# EAGLE design m328p_rfm69_node (EAGLE 7.2.0)
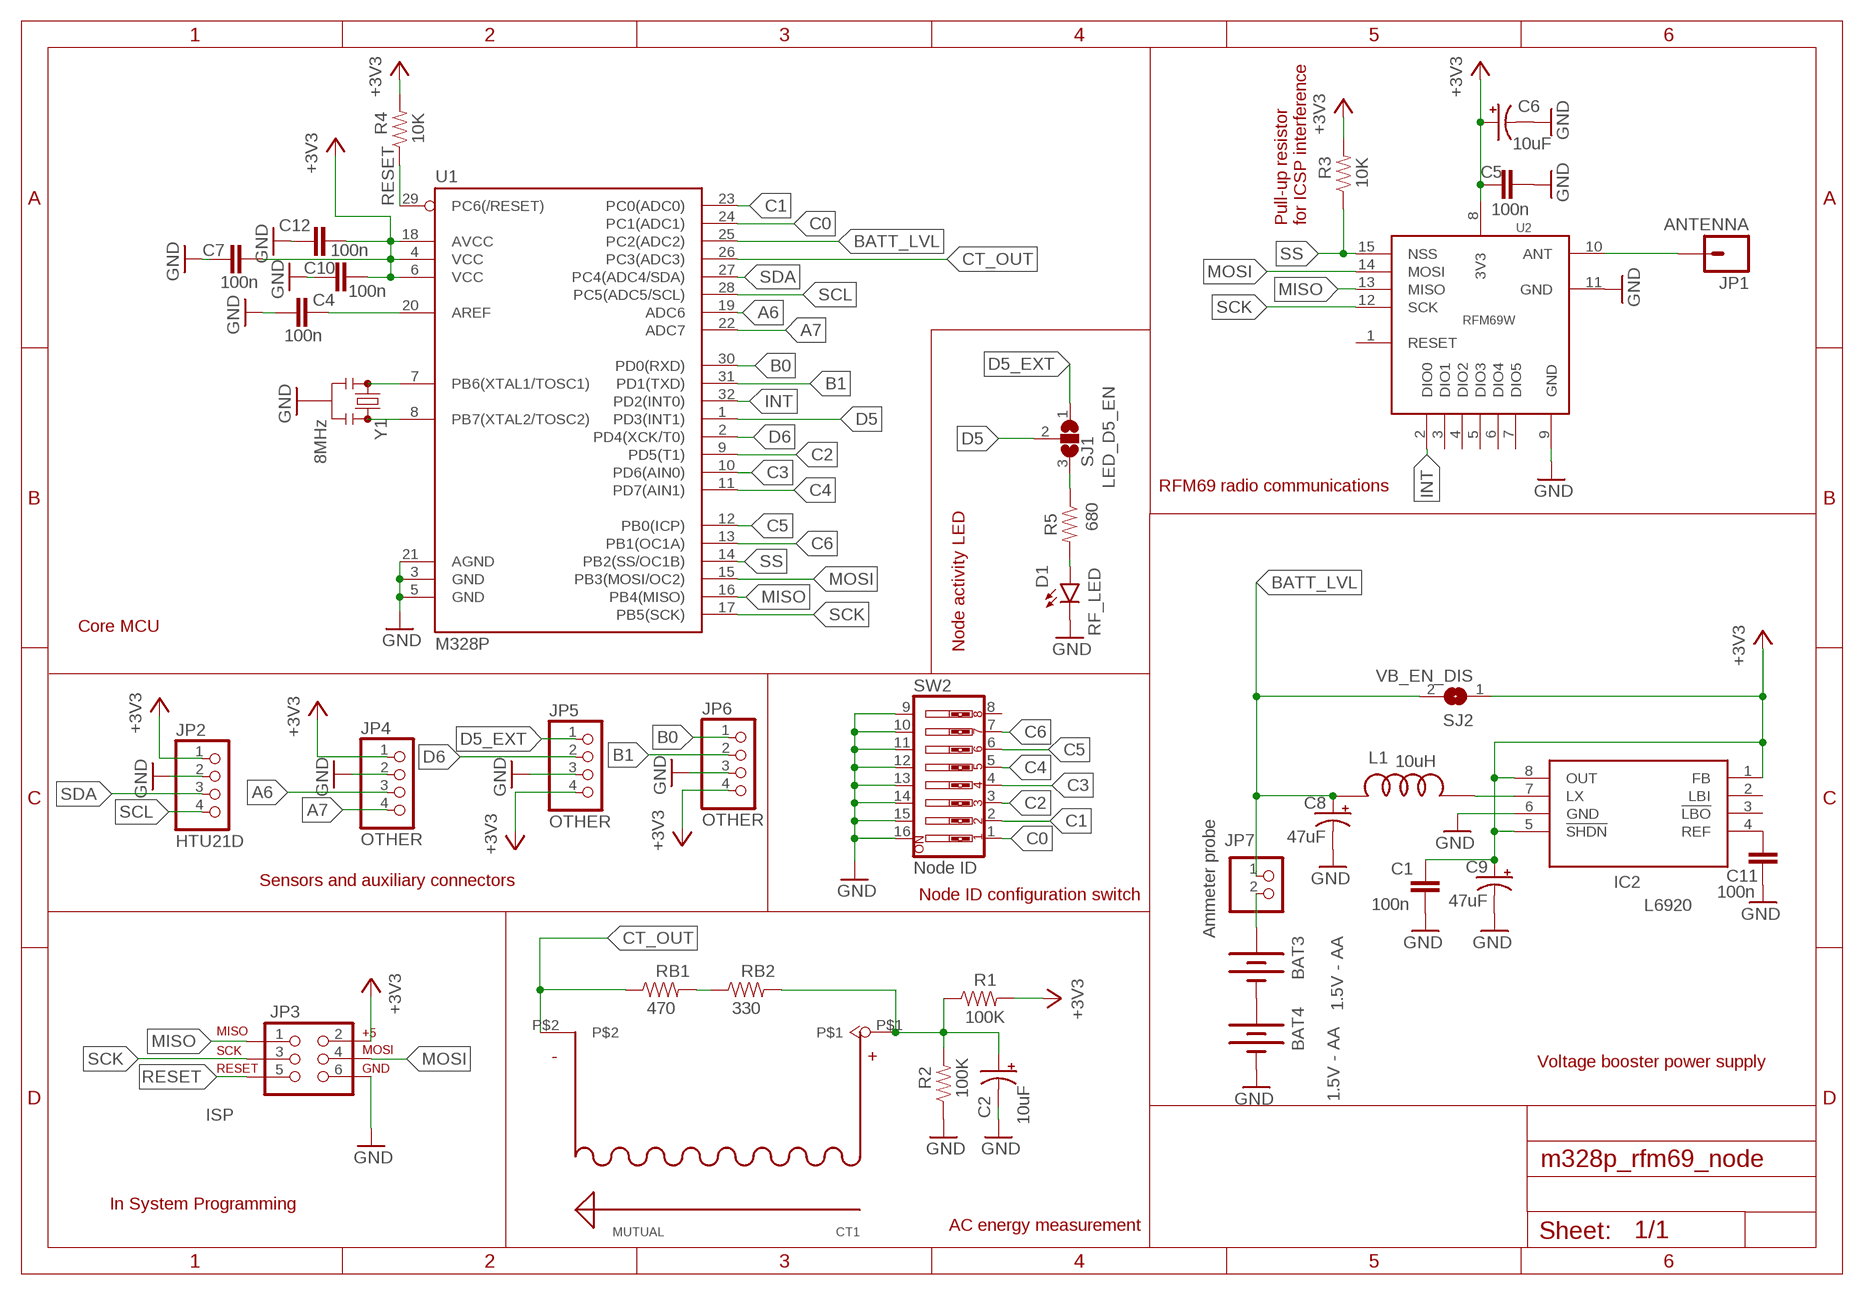
[diagram p0: schematic, sheet 1]

## Parts
BAT3  1.5V - AA  BATTERYAA-KIT  [BATTERY-AA-KIT]
BAT4  1.5V - AA  BATTERYAA-KIT  [BATTERY-AA-KIT]
C1  100n  CAP0805  [0805]
C2  10uF  47UF-TANT  [EIA3528]
C4  100n  CAP0805  [0805]
C5  100n  CAP0805  [0805]
C6  10uF  47UF-TANT  [EIA3528]
C7  100n  CAP0805  [0805]
C8  47uF  47UF-TANT  [EIA3528]
C9  47uF  47UF-TANT  [EIA3528]
C10  100n  CAP0805  [0805]
C11  100n  CAP0805  [0805]
C12  100n  CAP0805  [0805]
CT1  MUTUAL  [MUTUAL]
D1  RF_LED  LED0603  [LED-0603]
IC2  L6920  L6920TSSOP8  [TSSOP8]
JP1  ANTENNA  M01SMD  [LUXEON-PAD]
JP2  HTU21D  PINHD-1X4  [1X04]
JP3  ISP  AVR_SPI_PRG_6NS  [2X3-NS]
JP4  OTHER  PINHD-1X4  [1X04]
JP5  OTHER  PINHD-1X4  [1X04]
JP6  OTHER  PINHD-1X4  [1X04]
JP7  Ammeter probe  PINHD-1X2  [1X02]
L1  10uH  DLJ-4018  [DLJ-4018]
R1  100K  RESISTOR0805-RES  [0805]
R2  100K  RESISTOR0805-RES  [0805]
R3  10K  RESISTOR0805-RES  [0805]
R4  10K  RESISTOR0805-RES  [0805]
R5  680  RESISTOR0805-RES  [0805]
RB1  470  RESISTOR0805-RES  [0805]
RB2  330  RESISTOR0805-RES  [0805]
SJ1  LED_D5_EN  SJ2W  [SJ_2]
SJ2  VB_EN_DIS  SJ  [SJ]
SW2  Node ID  SW_DIP-8-SMT-HALFSIZE  [DIPSWITCH-08-50MIL]
U1  M328P  ATMEGA328P_TQFP  [TQFP32-08]
U2  RFM69W  [RFM69W]
Y1  8MHz  RESONATOR4MHZ  [RESONATOR-SMD_MED]

## Nets
+3V3: C1.1 C5.1 C6.A(+) C7.2 C9.A(+) C10.2 C12.2 IC2.1(FB) IC2.5(!SHDN) IC2.8(OUT) JP2.1 JP3.2 JP4.1 JP5.4 JP6.4 R1.2 R3.2 R4.2 SJ2.1 U1.4(VCC) U1.6(VCC) U1.18(AVCC) U2.8(3V3)
A6: JP4.3 U1.19(ADC6)
A7: JP4.4 U1.22(ADC7)
B0: JP6.1 U1.30(PD0(RXD))
B1: JP6.2 U1.31(PD1(TXD))
BATT_LVL: C8.A(+) JP7.1 L1.P$2 SJ2.2 U1.25(PC2(ADC2))
C0: SW2.1 U1.24(PC1(ADC1))
C1: SW2.2 U1.23(PC0(ADC0))
C2: SW2.3 U1.9(PD5(T1))
C3: SW2.4 U1.10(PD6(AIN0))
C4: SW2.5 U1.11(PD7(AIN1))
C5: SW2.6 U1.12(PB0(ICP))
C6: SW2.7 U1.13(PB1(OC1A))
CT_OUT: CT1.P$2 RB1.1 U1.26(PC3(ADC3))
D5: SJ1.2 U1.1(PD3(INT1))
D5_EXT: JP5.1 SJ1.1
D6: JP5.2 U1.2(PD4(XCK/T0))
GND: BAT4.GND@1(-) C1.2 C2.C(-) C4.1 C5.2 C6.C(-) C7.1 C8.C(-) C9.C(-) C10.1 C11.2 C12.1 D1.C IC2.6(GND) JP2.2 JP3.6 JP4.2 JP5.3 JP6.3 R2.1 SW2.9 SW2.10 SW2.11 SW2.12 SW2.13 SW2.14 SW2.15 SW2.16 U1.3(GND) U1.5(GND) U1.21(AGND) U2.9(GND) U2.11(GND) Y1.2
INT: U1.32(PD2(INT0)) U2.2(DIO0)
MISO: JP3.1 U1.16(PB4(MISO)) U2.13(MISO)
MOSI: JP3.4 U1.15(PB3(MOSI/OC2)) U2.14(MOSI)
N$1: IC2.7(LX) L1.P$1
N$2: D1.A R5.2
N$3: RB1.2 RB2.1
N$4: C11.1 IC2.4(REF)
N$5: BAT3.PWR@1(+) JP7.2
N$6: U1.8(PB7(XTAL2/TOSC2)) Y1.3
N$8: BAT3.GND@1(-) BAT4.PWR@1(+)
N$9: U1.7(PB6(XTAL1/TOSC1)) Y1.1
N$10: JP1.P$1 U2.10(ANT)
N$11: C2.A(+) CT1.P$1 R1.1 R2.2 RB2.2
N$12: C4.2 U1.20(AREF)
N$13: R5.1 SJ1.3
RESET: JP3.5 R4.1 U1.29(PC6(/RESET))
SCK: JP3.3 U1.17(PB5(SCK)) U2.12(SCK)
SCL: JP2.4 U1.28(PC5(ADC5/SCL))
SDA: JP2.3 U1.27(PC4(ADC4/SDA))
SS: R3.1 U1.14(PB2(SS/OC1B)) U2.15(NSS)
Unconnected: IC2.2(LBI) IC2.3(!LBO) SW2.8 U2.1(RESET) U2.3(DIO1) U2.4(DIO2) U2.5(DIO3) U2.6(DIO4) U2.7(DIO5)

## Notes on the sheet
- Pull-up resistor
  for ICSP interference
- RFM69 radio communications
- Core MCU
- Node activity LED
- Sensors and auxiliary connectors
- Node ID configuration switch
- Voltage booster power supply
- In System Programming
- AC energy measurement

## Library data of the parts
BAT3 BAT4 = SparkFun-Electromechanical:BATTERY: Battery Holders Various common sizes : AA, AAA, 18650 (PRT-12895), 20mm coin cell and 12mm coin cell. 20MM_4LEGS, BATT-10373; PROD_ID: BATT-08316
C1 C4 C5 C7 C10-C12 = SparkFun-Capacitors:CAP: Capacitor Standard 0603 ceramic capacitor, and 0.1" leaded capacitor.
C2 C6 = SparkFun-Capacitors:47UF-TANT: 47uF Tantalum SMT CAP-08310- 10V 10% (EIA-3528); PROD_ID: CAP-08310; VALUE: 47uF
C8 C9 = SparkFun-Capacitors:47UF-TANT: 47uF Tantalum SMT CAP-08310- 10V 10% (EIA-3528); PROD_ID: CAP-08310
CT1 = Electricity_sensor:MUTUAL
D1 = SparkFun-LED:LED: LEDs Standard schematic elements and footprints for 5mm, 3mm, 1206, and 0603 sized LEDs. 5mm - Spark Fun Electronics SKU : COM-00529 (and others)
IC2 = l6920:L6920
JP1 = SparkFun-Connectors:M01: Header 1 Standard 1-pin 0.1" header. Use with straight break away headers (SKU : PRT-00116), right angle break away headers (PRT-00553), swiss pins (PRT-00743), machine pins (PRT-00117), and female headers (PRT-00115).
JP2 JP4-JP6 = pinhead:PINHD-1X4: PIN HEADER
JP3 = SparkFun-Connectors:AVR_SPI_PRG_6: AVR ISP 6 Pin This is the reduced ISP connector for AVR programming. Common on Arduino. This footprint will take up less PCB space and can be used with a 10-pin to 6-pin adapter such as SKU: BOB-08508 **Special note about "TEST_POINT" package. The stop mask is on the top side, so if you want your programming test points to be on the bottom of your board, make sure to place this package on the bottom side of the board. This also ensure that the orientation to program from the bottom side will be correct.
JP7 = pinhead:PINHD-1X2: PIN HEADER
L1 = dlj-4018:DLJ-4018
R1-R4 RB1 RB2 = SparkFun-Resistors:RESISTOR: Resistor Basic schematic elements and footprints for 0603, 1206, and PTH resistors.
R5 = SparkFun-Passives:RESISTOR: Resistor Basic schematic elements and footprints for 0603, 1206, and PTH resistors.
SJ1 = jumper:SJ2W: SMD solder JUMPER
SJ2 = jumper:SJ: SMD solder JUMPER
SW2 = SparkFun-Electromechanical:SW_DIP-8: DIP Switch 8 Position
U1 = SparkFun-DigitalIC:ATMEGA328P_TQFP; PROD_ID: IC-09069; VALUE: ATMEGA328P_TQFP
U2 = rfm69w:RFM69W: Radio Transceiver Module, FSK, 433, 848, 915 MHz, SPI controlled, Mfr=HopeRF
Y1 = SparkFun-FreqCtrl:RESONATOR: Resonator Small SMD resonator. Used, eg, on the Arduino Pro/ Pro Mini boards. 8MHz- XTAL-08895 16MHz- XTAL-08900; PROD_ID: XTAL-12492; VALUE: 4MHz

## Board
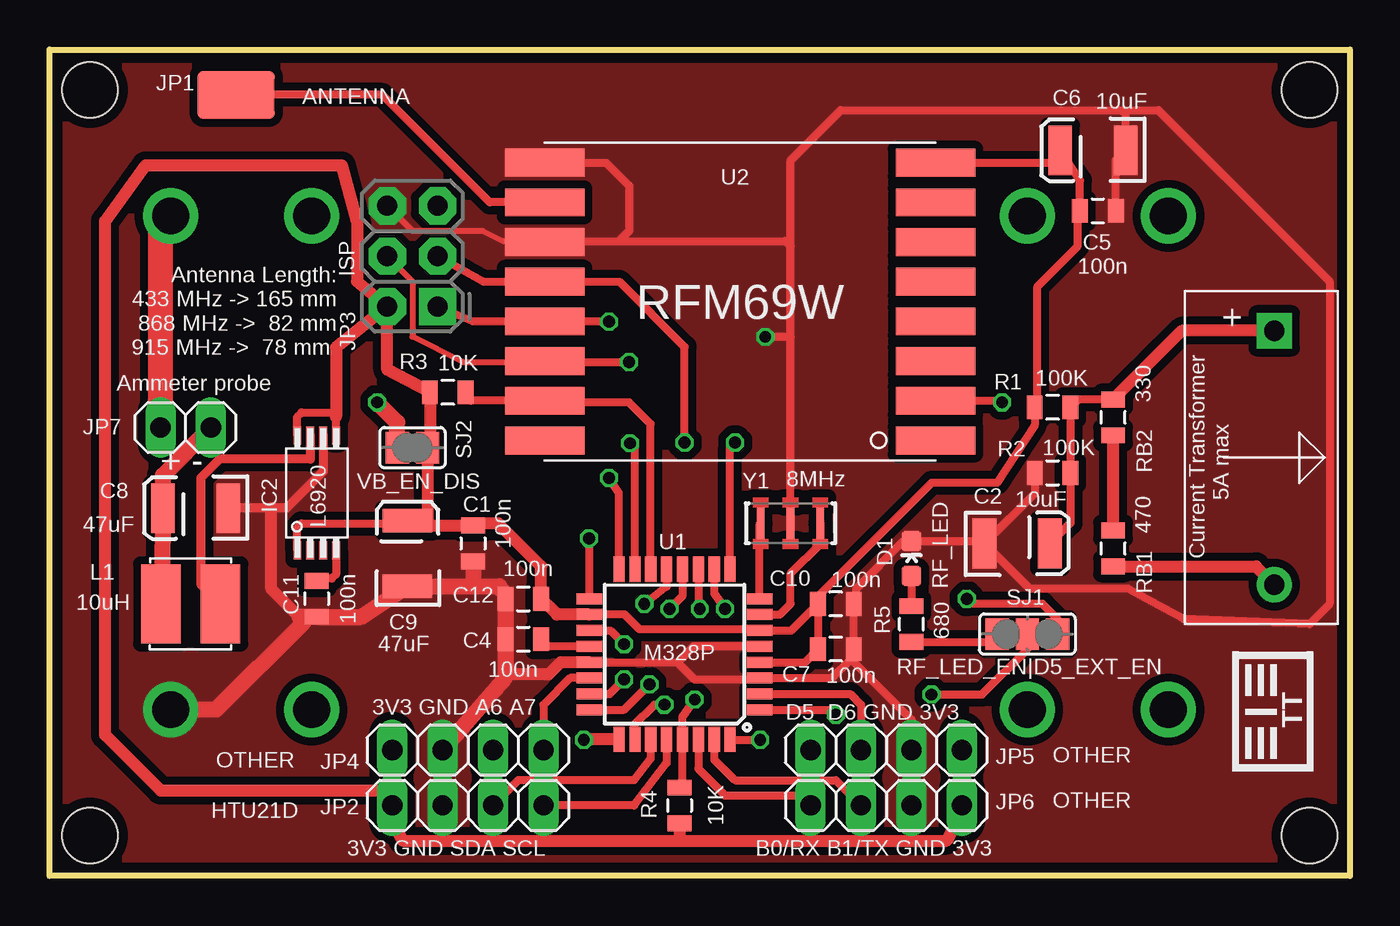
[diagram p1: board, top side]
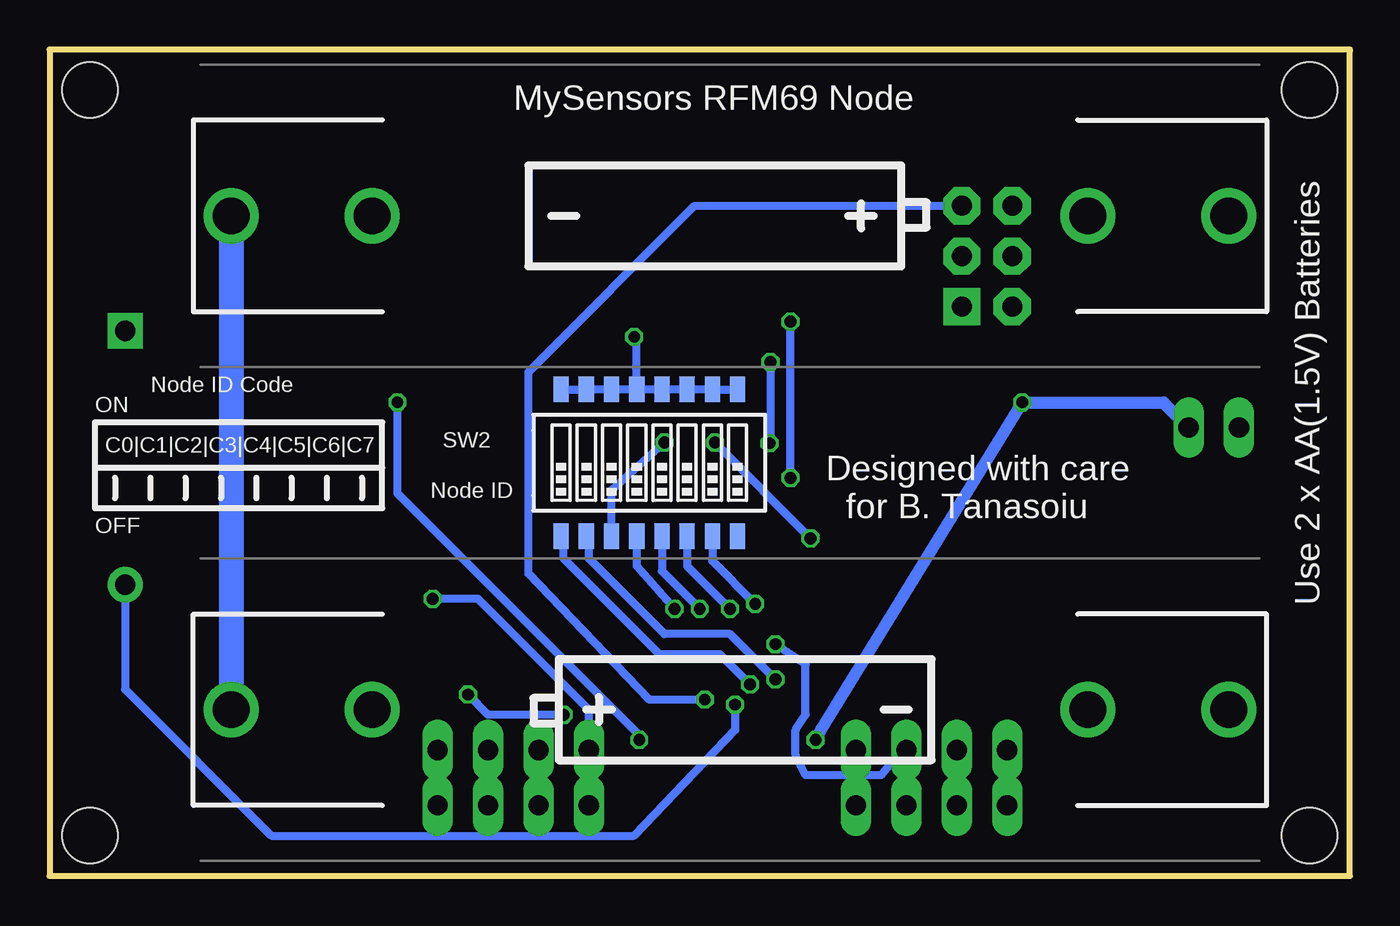
[diagram p2: board, bottom side, seen from below]

Size 65.53 x 41.66 mm. Coordinates in mm from the lower left corner, seen from the top.
Outline: 0,41.66 65.53,41.66 65.53,0
Outline: 65.51,0 0,0 0,41.58
Copper layers (1*16): Top 0.035mm / dielectric 1.5mm / Bottom 0.035mm
Design rules "smart-proto *": minimum track width 7mil, minimum drill 12mil, track to track 7mil, track to pad 7mil, pad to pad 7mil, via to via 7mil, smd to smd 0mil, copper to edge 20mil, drill to drill 10mil, minimum pad ring 10mil, minimum via ring 6mil, stop-mask expansion 2mil, vias tented up to drill 25mil, thermal gap 10mil
Holes 2.8 mm at 2.03,39.62 2.03,2.03 63.5,2.03 63.5,39.62

### Footprints (pad centres in the part's own frame; a part is rotated, then mirrored left to right if it is on the bottom)
BATTERY-AA-KIT = drill 1.854: GND@1 25.146,0; GND@2 18.034,0; PWR@1 -25.146,0; PWR@2 -18.034,0
0805 = smd 0.8 x 1.2: 1 -0.9,0; 2 0.9,0
EIA3528 = smd 1.2 x 2.5: A 1.65,0; C -1.65,0
MUTUAL = drill 1.016 pad 1.778 square: P$1 -6.4,0 | drill 1.016 pad 1.778: P$2 6.4,0
LED-0603 = smd 1 x 1: A 0,-0.877; C 0,0.877
TSSOP8 = smd 0.4 x 0.9: 1 -0.975,-2.9; 2 -0.325,-2.9; 3 0.325,-2.9; 4 0.975,-2.9; 5 0.975,2.9; 6 0.325,2.9; 7 -0.325,2.9; 8 -0.975,2.9
LUXEON-PAD = smd 3.9 x 2.4: P$1 0,0
1X04 = drill 1.016 long: 1 -3.81,0; 2 -1.27,0; 3 1.27,0; 4 3.81,0
2X3-NS = drill 1.016 pad 1.88 square: 1 -2.54,-1.27 | drill 1.016 pad 1.88 octagon: 2 -2.54,1.27; 3 0,-1.27; 4 0,1.27; 5 2.54,-1.27; 6 2.54,1.27
1X02 = drill 1.016 long: 1 -1.27,0; 2 1.27,0
DLJ-4018 = smd 4 x 2: P$1 0,-1.5; P$2 0,1.5
SJ_2 = smd 1.168 x 1.6: 1 -1.524,0; 2 0,0; 3 1.524,0
SJ = smd 1.168 x 1.6: 1 -0.762,0; 2 0.762,0
DIPSWITCH-08-50MIL = smd 0.762 x 1.27: 1 -4.445,-3.7; 2 -3.175,-3.7; 3 -1.905,-3.7; 4 -0.635,-3.7; 5 0.635,-3.7; 6 1.905,-3.7; 7 3.175,-3.7; 8 4.445,-3.7; 9 4.445,3.7; 10 3.175,3.7; 11 1.905,3.7; 12 0.635,3.7; 13 -0.635,3.7; 14 -1.905,3.7; 15 -3.175,3.7; 16 -4.445,3.7
TQFP32-08 = smd 1.27 x 0.559: 1 -4.293,2.8; 2 -4.293,2; 3 -4.293,1.2; 4 -4.293,0.4; 5 -4.293,-0.4; 6 -4.293,-1.2; 7 -4.293,-2; 8 -4.293,-2.8; 17 4.293,-2.8; 18 4.293,-2; 19 4.293,-1.2; 20 4.293,-0.4; 21 4.293,0.4; 22 4.293,1.2; 23 4.293,2; 24 4.293,2.8 | smd 0.559 x 1.27: 9 -2.8,-4.293; 10 -2,-4.293; 11 -1.2,-4.293; 12 -0.4,-4.293; 13 0.4,-4.293; 14 1.2,-4.293; 15 2,-4.293; 16 2.8,-4.293; 25 2.8,4.293; 26 2,4.293; 27 1.2,4.293; 28 0.4,4.293; 29 -0.4,4.293; 30 -1.2,4.293; 31 -2,4.293; 32 -2.8,4.293
RFM69W = smd 4 x 1.4: 1 -9.85,7; 2 -9.85,5; 3 -9.85,3; 4 -9.85,1; 5 -9.85,-1; 6 -9.85,-3; 7 -9.85,-5; 8 -9.85,-7; 9 9.85,-7; 10 9.85,-5; 11 9.85,-3; 12 9.85,-1; 13 9.85,1; 14 9.85,3; 15 9.85,5; 16 9.85,7
RESONATOR-SMD_MED = smd 0.4 x 1.6: 1 -1.5,0; 2 0,0; 3 1.5,0

### Placement (x,y rotation side)
BAT3  31.24,33.27 180 bottom
BAT4  31.24,8.38 0 bottom
C1  21.34,16.76 270 top
C2  48.77,16.76 0 top
C4  23.88,11.94 0 top
C5  52.83,33.53 0 top
C6  52.58,36.58 180 top
C7  39.62,11.43 180 top
C8  7.37,18.54 180 top
C9  18.03,16.26 90 top
C10  39.62,13.72 180 top
C11  13.46,13.97 270 top
C12  23.88,13.97 0 top
CT1  61.72,21.08 270 top
D1  43.43,16 0 top
IC2  13.46,19.3 0 top
JP1  9.4,39.37 0 top
JP2  21.08,3.56 0 top
JP3  18.29,31.24 90 top
JP4  21.08,6.35 0 top
JP5  42.16,6.35 0 top
JP6  42.16,3.56 0 top
JP7  6.86,22.61 180 top
L1  7.11,13.72 90 top
R1  50.55,23.62 180 top
R2  50.55,20.32 0 top
R3  20.07,24.38 180 top
R4  31.75,3.56 270 top
R5  43.43,12.7 90 top
RB1  53.59,16.51 90 top
RB2  53.59,23.11 90 top
SJ1  49.28,12.19 180 top
SJ2  18.29,21.59 180 top
SW2  35.31,20.83 0 bottom
U1  31.5,11.18 180 top
U2  34.8,28.96 180 top
Y1  37.34,17.78 180 top

### Tracks (layer width: path | path; a pad name or v marks a point on that pad's centre or on a via)
+3V3
  Top 0.406: U1.18 27.23,13.21 28.96,13.21 29.72,12.45 35.72,12.45 U1.6 37.38,12.38 C10.2 | JP3.2 17.27,29.21 | C10.2 38.72,13.32 | U1.4 38.07,10.78 C7.2 C10.2 | C10.2 38.72,14.09 44.45,19.81 47.75,19.81 49.65,22.72 R1.2 49.78,23.76 49.78,29.72 51.82,31.75 51.82,33.41 C5.1 51.93,35.06 C6.A 50.56,35.96 U2.8 | IC2.8 12.49,23.16 12.7,23.37 14.22,23.37 14.44,23.16 IC2.5 | 21.09,17.65 C1.1 | IC2.1 12.49,17.57 12.7,17.78 17.91,17.78 C9.A
  Top 0.61: JP5.4 JP6.4 45.97,3.3 45.21,1.78 31.75,1.78 | JP2.1 JP4.1 | 31.75,1.78 17.78,1.78 17.27,2.79 JP2.1 | U1.18 25.57,13.18 C12.2 24.78,15.61 22.61,17.78 21.45,17.78 C1.1 | R4.2 31.75,1.78 | JP3.2 15.49,29.97 15.49,33.02 14.73,35.81 4.83,35.81 2.79,33.02 2.79,7.11 5.59,4.32 17.02,4.32 JP2.1 | JP3.2 17.02,25.52 R3.2 19.17,21.71 SJ2.1 19.05,17.65 | JP3.2 14.44,26.63 14.44,23.16 | 21.09,17.65 19.05,17.65 | 19.05,17.65 18.29,17.65 C9.A
A6  (via drill 0.6)
  Top 0.406: U1.19 28.26,12.38 v28.96,11.68
  Bottom 0.406: JP4.3 22.61,6.35 23.62,5.08 27.43,5.08 27.94,6.1 27.94,7.37 27.43,8.13 27.43,10.67 v28.96,11.68
A7
  Top 0.406: U1.22 26.23,9.98 24.89,8.64 JP4.4
B0
  Top 0.406: U1.30 32.7,5.4 34.04,4.06 37.85,4.06 JP6.1
B1
  Top 0.406: U1.31 33.5,5.87 34.54,4.83 39.62,4.83 JP6.2
BATT_LVL  (via drill 0.6)
  Top 0.61: U1.25 26.95,6.88 v26.92,6.86
  Top 0.813: SJ2.2 17.53,22.86 v16.51,23.88 | L1.P$2 C8.A 5.72,20.19 JP7.1
  Bottom 0.61: v26.92,6.86 26.64,7.39 v16.51,23.88 9.4,23.88 JP7.1
C0  (via drill 0.6)
  Top 0.406: U1.24 28.95,8.38 v30.23,9.65
  Bottom 0.406: v30.23,9.65 31.75,11.18 34.8,11.18 39.62,16 39.62,17 SW2.1
C1  (via drill 0.6)
  Top 0.406: U1.23 28.23,9.18 v28.96,9.91
  Bottom 0.406: v28.96,9.91 31.24,12.19 34.54,12.19 38.35,16 38.35,17 SW2.2
C2  (via drill 0.6)
  Top 0.406: U1.9 34.3,21.6 v34.54,21.84
  Bottom 0.406: SW2.3 37.21,19.43 v34.54,21.84
C3  (via drill 0.6)
  Top 0.406: U1.10 33.5,14.26 v34.04,13.46
  Bottom 0.406: SW2.4 35.94,15.62 v34.04,13.46
C4  (via drill 0.6)
  Top 0.406: U1.11 32.7,13.53 v32.77,13.46
  Bottom 0.406: SW2.5 34.67,15.37 v32.77,13.46
C5  (via drill 0.6)
  Top 0.406: U1.12 31.9,14.12 v31.24,13.46
  Bottom 0.406: SW2.6 33.4,15.62 v31.24,13.46
C6  (via drill 0.6)
  Top 0.406: U1.13 31.1,14.59 v29.97,13.72
  Bottom 0.406: SW2.7 32.13,15.88 v29.97,13.72
CT_OUT  (via drill 0.6)
  Top 0.406: U1.26 29.46,6.92 29.46,7.62 30.48,8.64 v30.99,8.64
  Top 0.61: RB1.1 60.79,15.61 CT1.P$2
  Bottom 0.406: CT1.P$2 61.72,9.4 54.36,2.03 36.07,2.03 30.99,7.37 v30.99,8.64
D5  (via drill 0.6)
  Top 0.406: U1.1 39.38,8.38 v39.62,8.13 | v44.45,9.14 46.99,9.14 49.28,11.43 SJ1.2
  Bottom 0.406: v39.62,8.13 43.43,8.13 v44.45,9.14
D5_EXT  (via drill 0.6)
  Top 0.406: SJ1.1 50.8,12.95 50.04,13.72 46.48,13.72 v46.23,13.97
  Bottom 0.406: JP5.1 38.35,8.38 43.94,13.97 v46.23,13.97
D6
  Top 0.406: U1.2 40.35,9.18 40.89,8.64 JP5.2
GND  (via drill 0.6)
  Top 0.305: JP3.6 18.29,32.51 21.84,32.51 22.86,32 24.9,32 U2.11
  Top 0.406: U1.21 31.64,10.78 | 31.64,10.78 32.51,9.91 35.72,9.91 U1.3 39.44,9.98 40.39,10.92 | U1.5 32.44,11.58 31.64,10.78 | R2.1 49.65,19.29 C2.C | Y1.2 37.34,27.18 | 37.34,27.18 37.34,31.75 | U2.11 25,32 28.7,32 | 28.7,32 37.08,32 37.34,31.75 | C12.1 22.98,14.22 | 40.39,10.92 40.39,11.29 C7.1 C10.1 40.64,13.83 40.64,14.48 43.04,16.88 D1.C 46.49,16.88 C2.C | U2.9 28.05,35.96 29.21,34.8 29.21,32.51 28.7,32 | 22.66,14.61 22.66,14.54 | 21.34,14.86 21.59,14.61 | v36.07,27.18 37.34,27.18 | 37.34,31.75 37.34,36.07 39.88,38.61 53.85,38.61 | 53.85,38.61 55.88,38.61 64.52,29.97 64.52,13.72 63.5,12.7 57.15,12.95 54.36,14.48 49.4,14.48 C2.C | C5.2 53.73,36.08 C6.C 54.23,38.48 53.85,38.61 | 40.39,10.92 43.43,7.87 JP5.3 JP6.3 | 47.24,16.13 C2.C
  Top 0.457: IC2.6 13.79,20.39 11.94,18.54 11.18,18.54 C8.C
  Top 0.61: U1.21 25.76,10.78 25.15,10.16 22.98,10.16 | 12.58,13.07 11.18,14.48 11.18,18.54
  Top 0.813: JP2.2 JP4.2 22.98,10.02 22.98,10.16 C4.1 C12.1 | 22.98,14.22 22.66,14.54 | 22.66,14.61 21.59,14.61 C9.C 15.74,13.07 C11.2 12.82,13.07 | C1.2 21.34,14.86 | 12.82,13.07 12.58,13.07 | 12.82,13.07 12.82,12.82 8.38,8.38 BAT4.GND@1
  Bottom 0.406: SW2.13 SW2.12 SW2.11 SW2.10 SW2.9 | SW2.13 SW2.14 SW2.15 SW2.16 | SW2.13 35.94,27.05 v36.07,27.18
  pour Top (isolate 0.406, no thermals): 0,41.66 65.53,41.66 65.53,0 0,0
INT  (via drill 0.6)
  Top 0.406: U1.32 34.3,6.85 36.06,6.85 v35.81,6.86 | 44.57,23.88 U2.2 47.93,23.96 v48.01,23.88
  Bottom 0.406: v35.81,6.86 35.81,7.11 48.01,19.3 v48.01,23.88
MISO  (via drill 0.6)
  Top 0.406: v28.19,27.94 24.96,27.94 U2.13 21.32,27.96 JP3.1 | U1.16 28.7,19.31 v28.19,20.07
  Bottom 0.406: v28.19,20.07 v28.19,27.93 v28.19,27.94
MOSI  (via drill 0.6)
  Top 0.305: JP3.4 18.29,29.97 18.29,27.18 20.83,25.91 24.9,25.91 U2.14
  Top 0.406: U2.14 25,25.91 v29.21,25.91 | U1.15 29.5,21.56 v29.24,21.81
  Bottom 0.406: v29.21,25.91 29.21,21.84 v29.24,21.81
N$1
  Top 0.457: IC2.7 13.14,21.01 8.56,21.01 7.62,20.07 7.62,14.71 L1.P$1
N$2
  Top 0.406: D1.A R5.2
N$3
  Top 0.61: RB2.1 RB1.2
N$4
  Top 0.406: IC2.4 14.44,15.2 14.22,14.99 13.58,14.99 C11.1
N$5
  Top 1.27: JP7.2 5.59,32.77 BAT3.PWR@1
N$6
  Top 0.406: U1.8 35.79,17.73 Y1.3
N$8
  Bottom 1.27: BAT3.GND@1 BAT4.PWR@1
N$9
  Top 0.406: U1.7 36.8,13.18 37.34,13.72 37.34,15.24 38.86,16.76 38.86,17.76 Y1.1
N$10
  Top 0.406: U2.10 22.18,33.96 16.76,39.37 JP1.P$1
N$11
  Top 0.406: C2.A 51.45,17.79 R2.2 R1.1 51.84,24.01 RB2.2
  Top 0.61: RB2.2 57.06,27.48 CT1.P$1
N$12
  Top 0.406: U1.20 25.14,11.58 C4.2
N$13
  Top 0.406: R5.1 47.36,11.8 SJ1.3
RESET  (via drill 0.6)
  Top 0.406: R4.1 31.87,4.57 31.87,6.85 U1.29 31.9,8.02 v32.51,8.89
  Bottom 0.406: v32.51,8.89 35.31,8.89 41.4,15.24 41.4,25.4 33.02,33.78 JP3.5
SCK  (via drill 0.6)
  Top 0.406: v27.18,17.02 27.18,14 U1.17 | JP3.3 21.84,29.97 24.93,29.97 U2.12 28.72,29.96 32,26.67 v32,21.84
  Bottom 0.406: v27.18,17.02 v32,21.84
SCL
  Top 0.406: U1.28 31.1,5.7 29.46,3.56 JP2.4
SDA
  Top 0.406: U1.27 30.3,5.91 29.46,4.83 23.62,4.83 JP2.3
SS
  Top 0.406: U1.14 30.3,22.79 29.21,23.88 25.03,23.88 U2.15 21.22,23.96 R3.1

### Text on the board
tPlace: Antenna Length: / 433 MHz -> 165 mm / 868 MHz -> 82 mm / 915 MHz -> 78 mm | + - | Current Transformer / 5A max | RF_LED_EN|D5_EXT_EN | TT | 3V3 GND A6 A7 | D5 D6 GND 3V3 | 3V3 GND SDA SCL | B0/RX B1/TX GND 3V3
bPlace: MySensors RFM69 Node | Use 2 x AA(1.5V) Batteries | Node ID Code | ON | C0|C1|C2|C3|C4|C5|C6|C7 | Designed with care / for B. Tanasoiu | OFF